# EasyEDA Pro project A.R.A 2.0.eprj

# Schematic A.R.A
Create Date: 2025-09-01; Page Name: Sheet_1; Project Name: A.R.A 2.0; Schematic Name: A.R.A; Update Date: 2025-09-02; Add into BOM: yes; Company: jreg2205; Convert to PCB: yes; Date: 2023-09-27; Draw By: jreg2205; REV: 1.0; Sheet: 1/1; spicePre: .
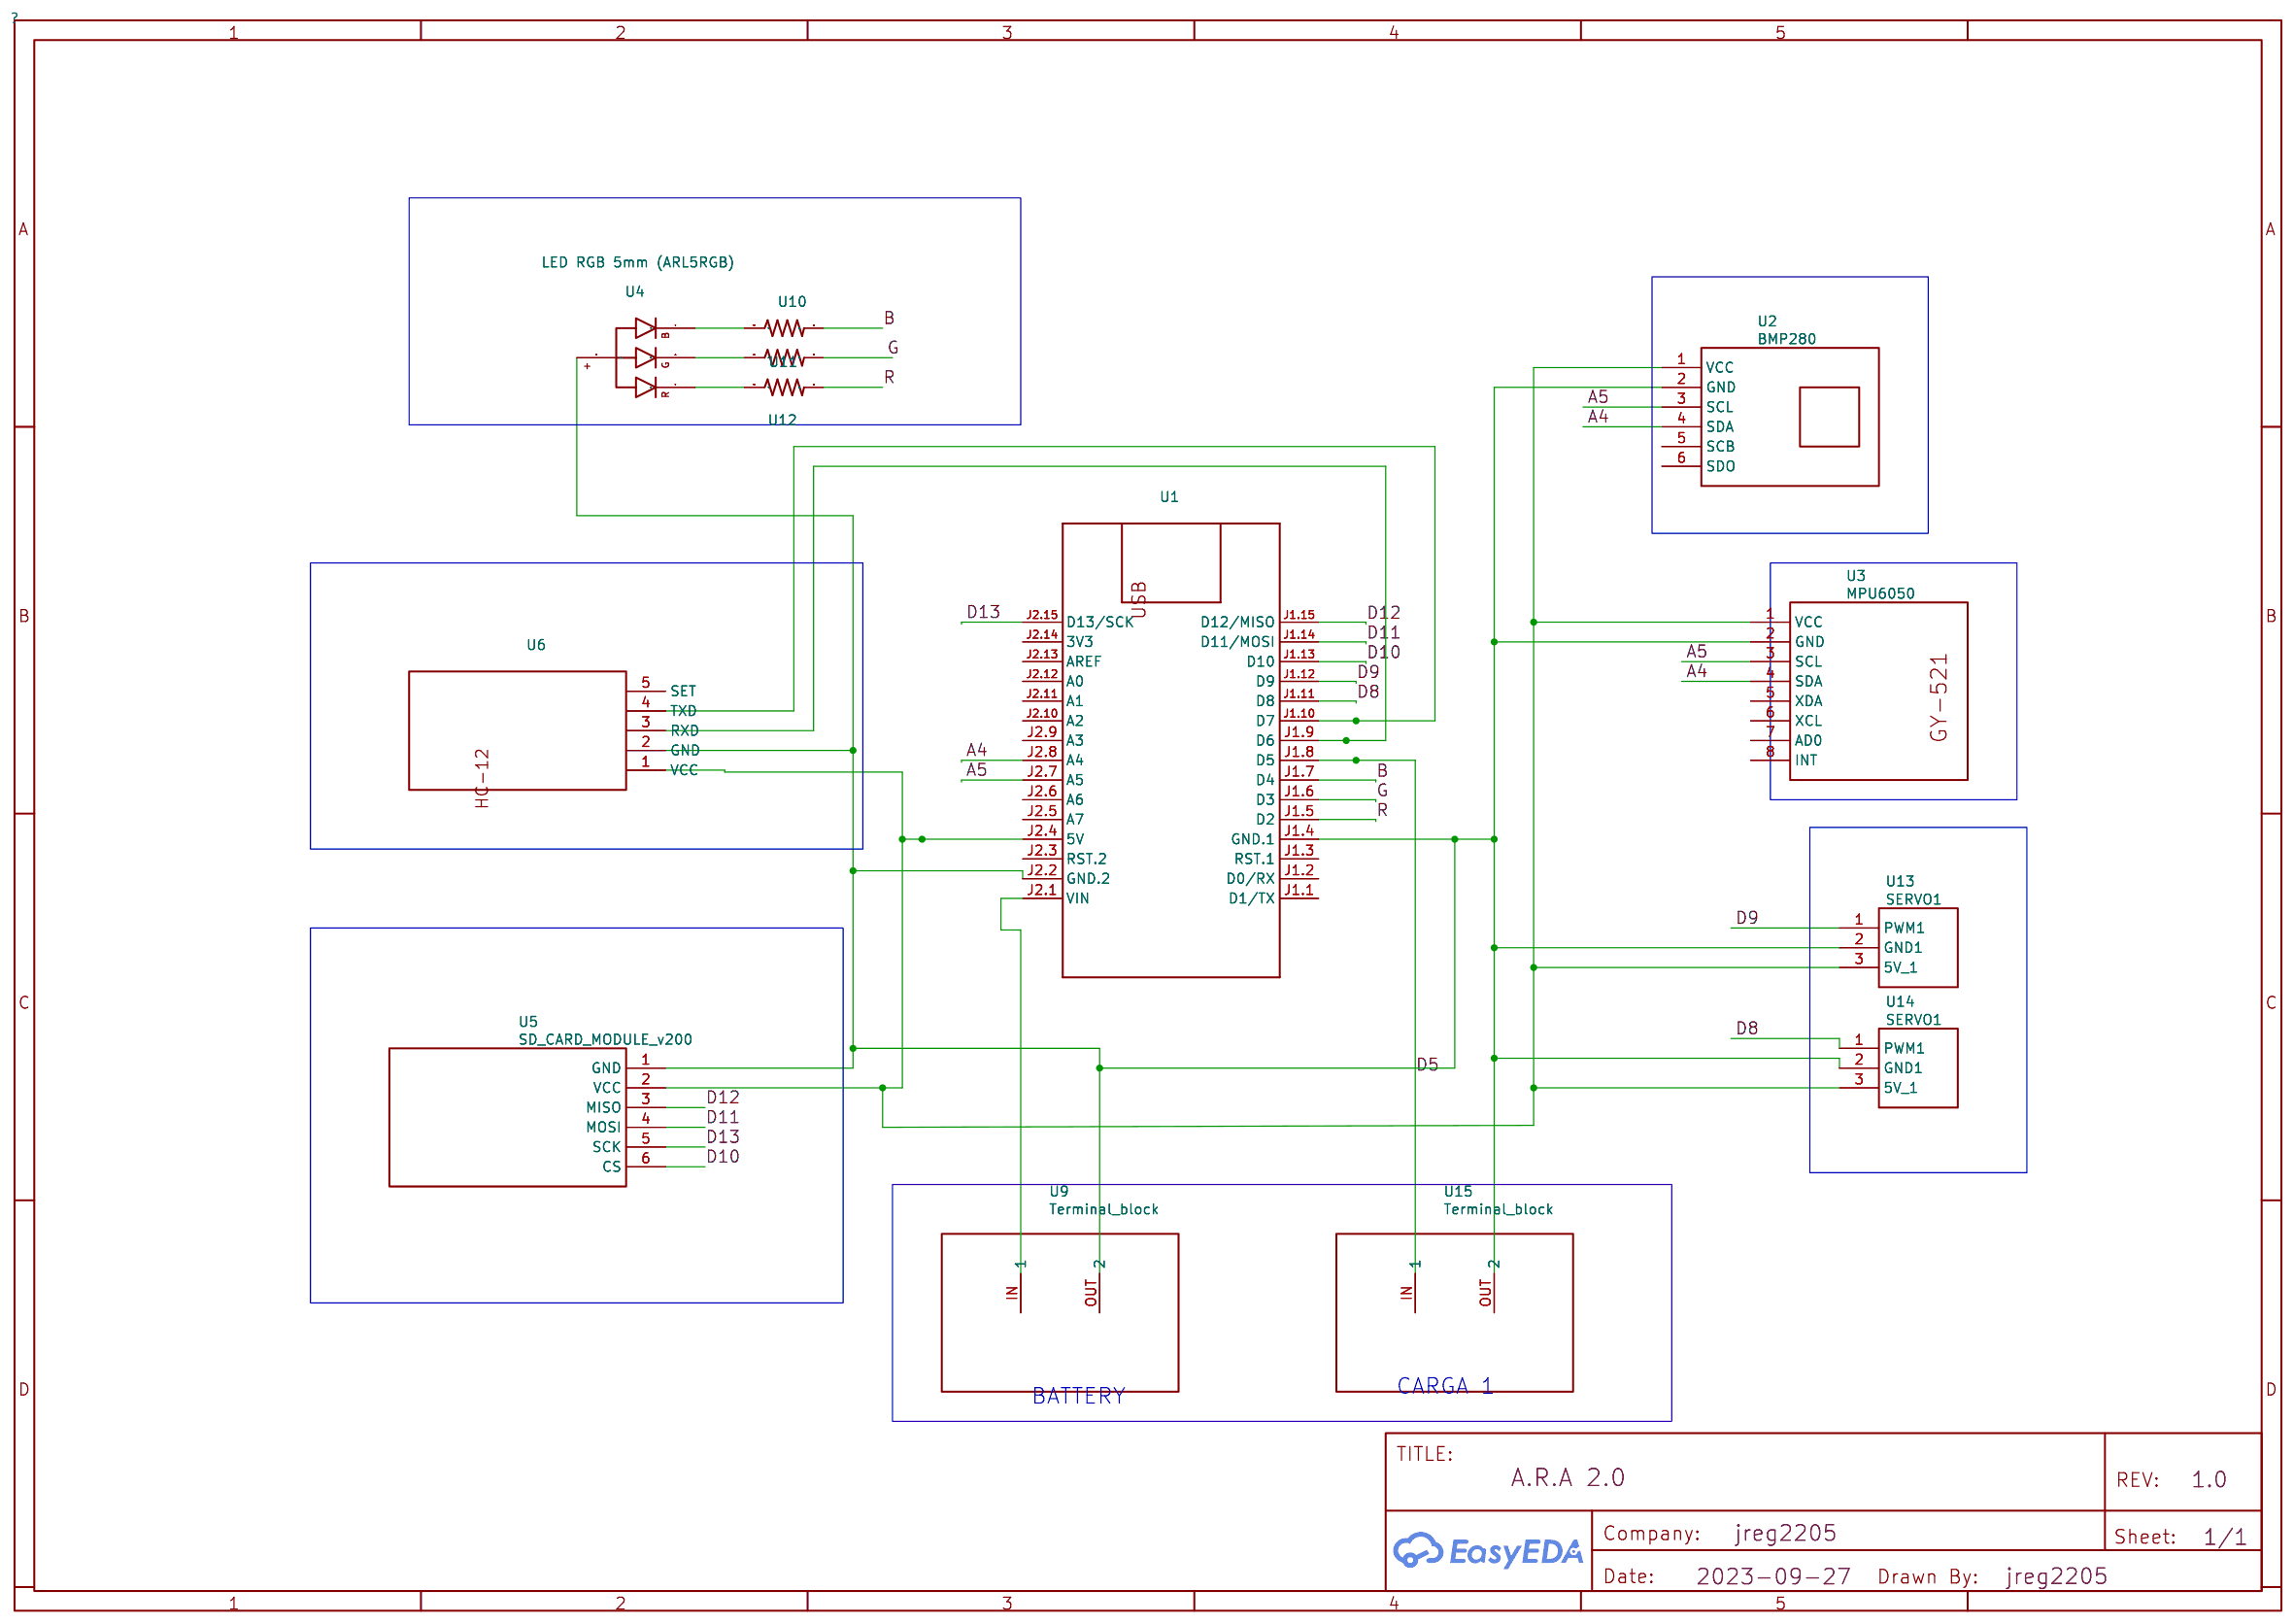
[diagram p0: schematic sheet]

## Parts
U1  NO  [ARDUINO-NANO-3.0]
U2  BMP280  [BMP280]
U3  MPU6050  [MPU6050]
U4  LED RGB 5mm (ARL5RGB)  [LED RGB 5MM (ARL5RGB)]
U5  SD_CARD_MODULE_v200  [SD_CARD_V20]
U6  NO  [HC-12 V2.0]
U9  Terminal_block  [TERMINAL_BLOCK]
U10  NO  [AXIAL-0.3]
U11  NO  [AXIAL-0.3]
U12  NO  [AXIAL-0.3]
U13  SERVO1  [SERVO1]
U14  SERVO1  [SERVO1]
U15  Terminal_block  [TERMINAL_BLOCK]

## Library data of the parts
U1 = NO: Contributor: santiagoM; spicePre: M; spiceSymbolName: ARDUINO-NANO-3.0 COPY
U2 = BMP280: Contributor: modlfo; spicePre: U
U3 = MPU6050: Supplier: Digi-Key; Contributor: lizzie; spicePre: U
U4 = LED RGB 5mm (ARL5RGB): Contributor: victornp22; spicePre: U
U5 = SD_CARD_MODULE_v200: Contributor: jreg2205; spicePre: U
U6 = NO: Contributor: jreg2205; spicePre: U; spiceSymbolName: HC-12 v2.0
U9 U15 = Terminal_block: Contributor: jreg2205; spicePre: U
U10-U12 = NO: Contributor: jreg2205; spicePre: R; spiceSymbolName: 330OHM-HORIZ-1/10W-5%
U13 U14 = SERVO1: Contributor: 김동건; spicePre: U

## Nets
A4: U1.J2.8(A4) U2.4(SDA) U3.4(SDA)
A5: U1.J2.7(A5) U2.3(SCL) U3.3(SCL)
B: U1.J1.7(D4) U10.P$2(2)
D5: U1.J1.8(D5) U15.IN(1)
D8: U1.J1.11(D8) U14.1(PWM1)
D9: U1.J1.12(D9) U13.1(PWM1)
D10: U1.J1.13(D10) U5.6(CS)
D11: U1.J1.14(D11/MOSI) U5.4(MOSI)
D12: U1.J1.15(D12/MISO) U5.3(MISO)
D13: U1.J2.15(D13/SCK) U5.5(SCK)
G: U1.J1.6(D3) U11.P$2(2)
R: U1.J1.5(D2) U12.P$2(2)
Net-(U1-J1.4): U1.J1.4(GND.1) U1.J2.2(GND.2) U2.2(GND) U3.2(GND) U4.2 U5.1(GND) U6.2(GND) U9.OUT(2) U13.2(GND1) U14.2(GND1) U15.OUT(2)
Net-(U1-J1.9): U1.J1.9(D6) U6.3(RXD)
Net-(U1-J1.10): U1.J1.10(D7) U6.4(TXD)
Net-(U1-J2.1): U1.J2.1(VIN) U9.IN(1)
Net-(U1-J2.4): U1.J2.4(5V) U2.1(VCC) U3.1(VCC) U5.2(VCC) U6.1(VCC) U13.3(5V_1) U14.3(5V_1)
Net-(U4-1): U4.1 U12.P$1(1)
Net-(U4-3): U4.3 U11.P$1(1)
Net-(U4-4): U4.4 U10.P$1(1)

Not connected (* = marked no-connect by the designer): U1 J1.1(D1/TX) J1.2(D0/RX) J1.3(RST.1) J2.3(RST.2) J2.5(A7) J2.6(A6) J2.9(A3) J2.10(A2) J2.11(A1) J2.12(A0) J2.13(AREF) J2.14(3V3); U2 5(SCB) 6(SDO); U3 5(XDA) 6(XCL) 7(AD0) 8(INT); U6 5(SET)

## Notes on the sheet
- BATTERY
- CARGA 1
